# Altium schematic sheet SecurityNode.SchDoc: SecurityNode
size A3; Author: Jeronimo Vargas Orozco; Revision: 1.0; SheetNumber: 1; SheetTotal: 1
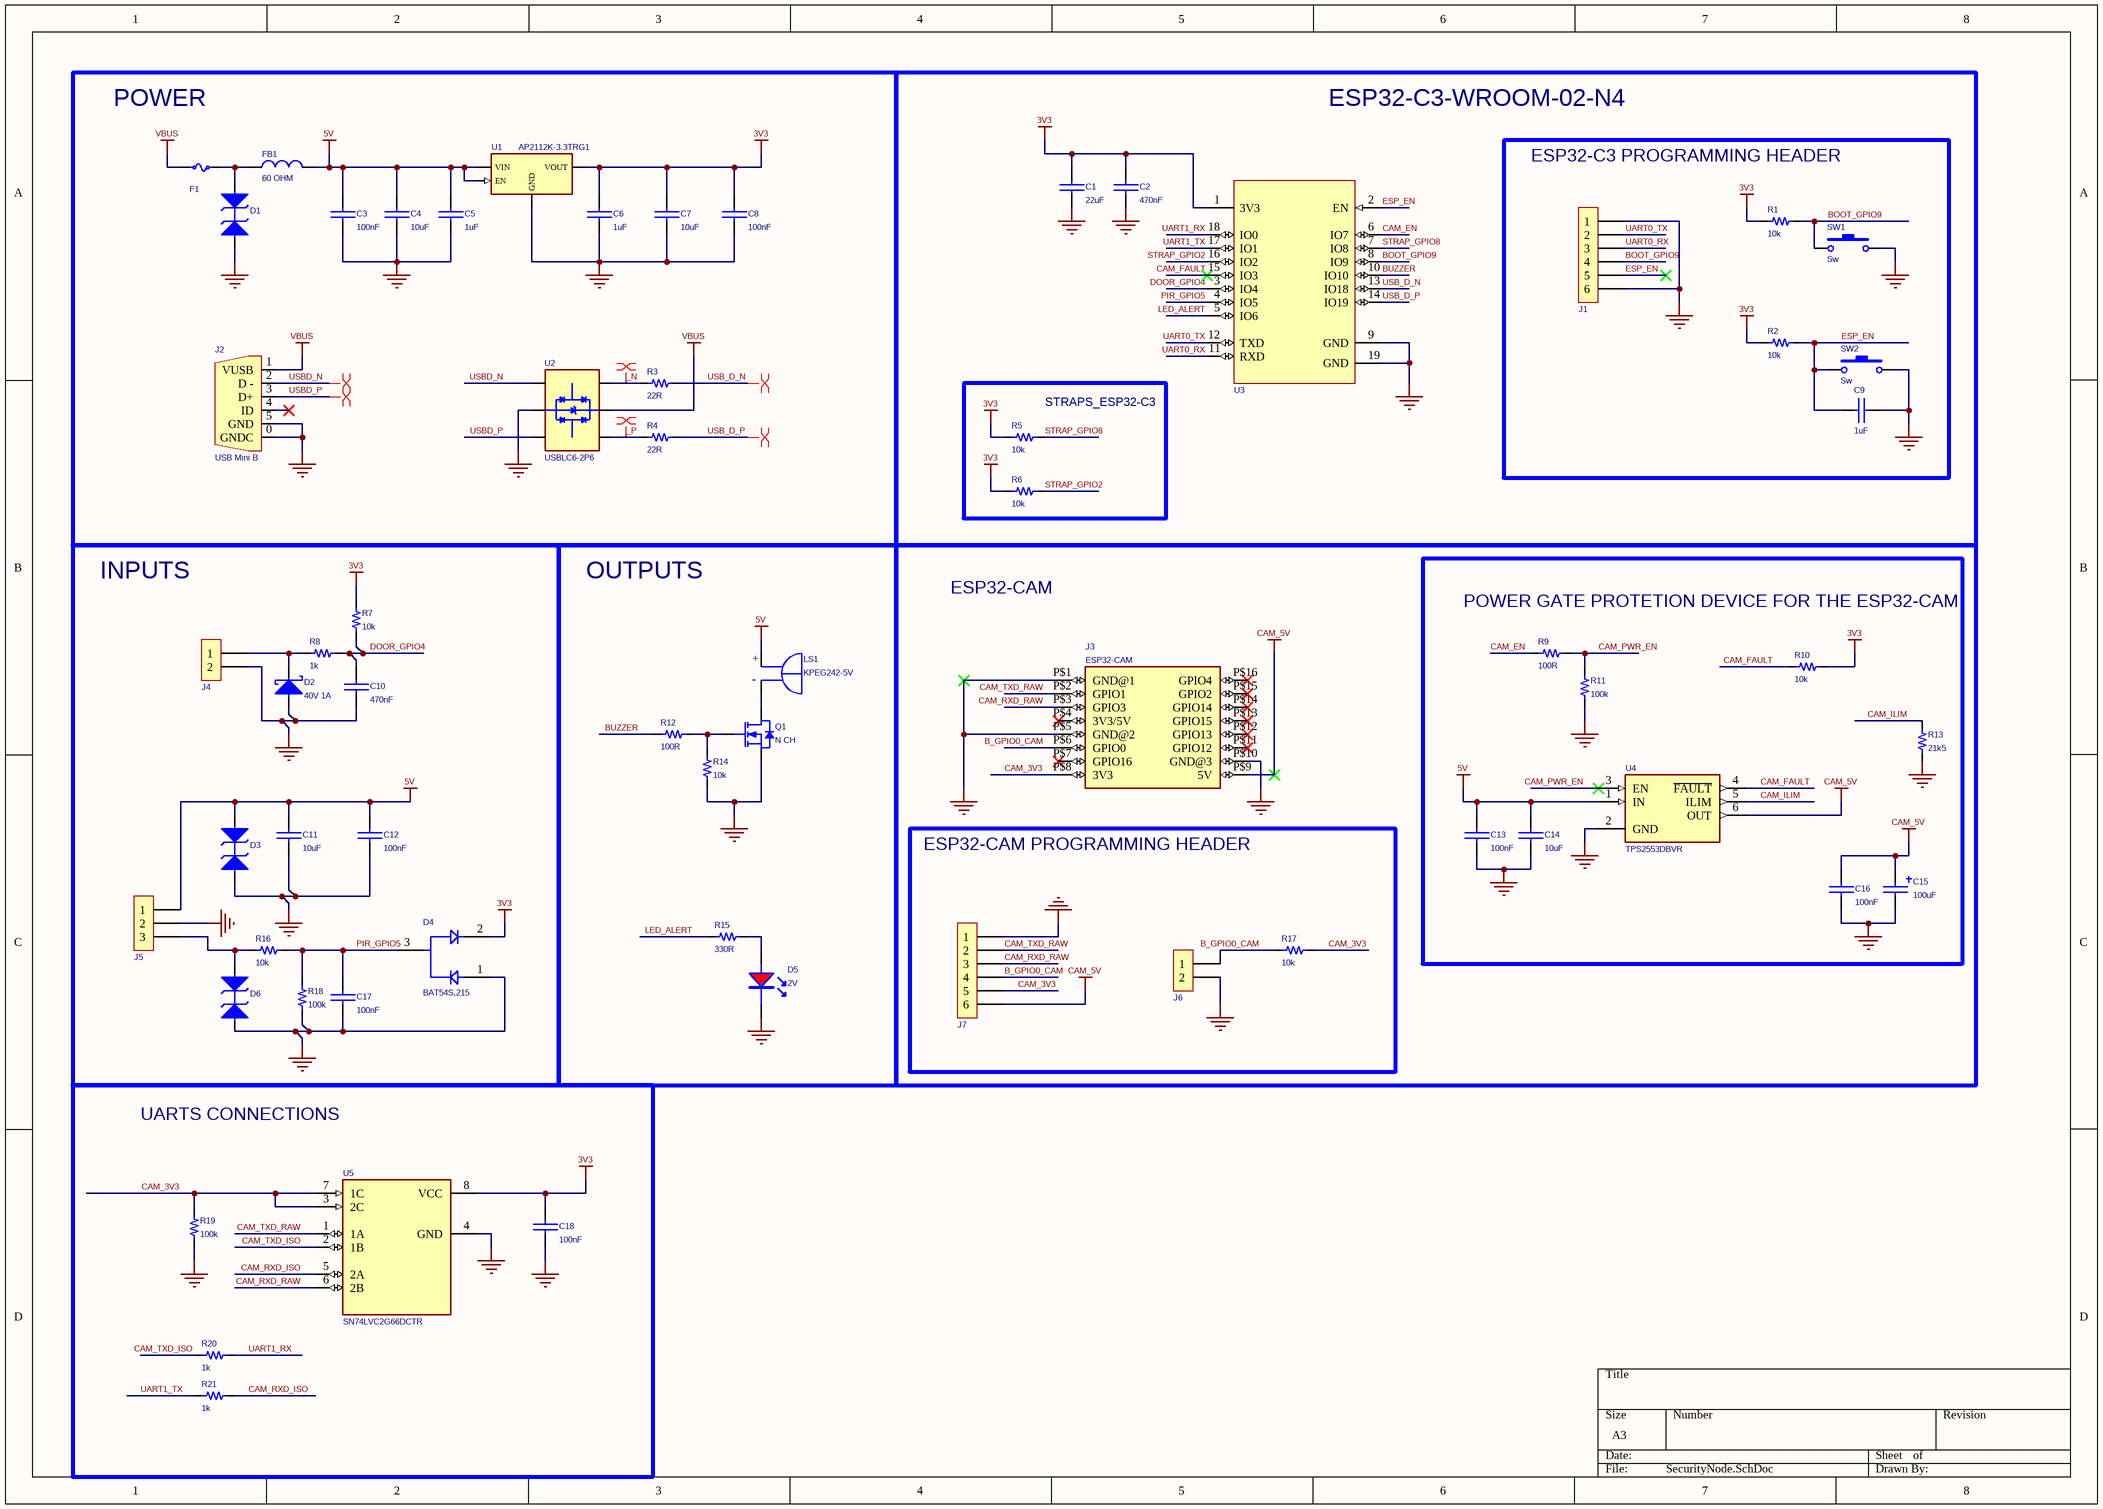
[diagram p0: SecurityNode.SchDoc]

## Parts
C1  value 22uF  [0805_cap]  (hidden comment: 22uF 16V)
C2  value 470nF  [0603_cap]  (hidden comment: 470nF 50V)
C3  value 100nF  [0603_cap]  (hidden comment: 100nF 6.3V)
C4  value 10uF  [0603_cap]  (hidden comment: 10uF 10V)
C5  value 1uF  [0603_cap]  (hidden comment: 1uF 50V)
C6  value 1uF  [0603_cap]  (hidden comment: 1uF 50V)
C7  value 10uF  [0603_cap]  (hidden comment: 10uF 10V)
C8  value 100nF  [0603_cap]  (hidden comment: 100nF 6.3V)
C9  value 1uF  [0603_cap]  (hidden comment: 1uF 50V)
C10  value 470nF  [0603_cap]  (hidden comment: 470nF 50V)
C11  value 10uF  [0603_cap]  (hidden comment: 10uF 10V)
C12  value 100nF  [0603_cap]  (hidden comment: 100nF 6.3V)
C13  value 100nF  [0603_cap]  (hidden comment: 100nF 6.3V)
C14  value 10uF  [0603_cap]  (hidden comment: 10uF 10V)
C15  value 100uF  [CAP_TH_2.5MM_6.3*12MM]  (hidden comment: 100uF 35V)
C16  value 100nF  [0603_cap]  (hidden comment: 100nF 6.3V)
C17  value 100nF  [0603_cap]  (hidden comment: 100nF 6.3V)
C18  value 100nF  [0603_cap]  (hidden comment: 100nF 6.3V)
D1  TVS 12V  [SOD_123FL]  (value not drawn)
D2  40V 1A  [SOD_123]
D3  TVS 12V  [SOD_123FL]  (value not drawn)
D4  BAT54S,215  [SOT23]
D5  2V  [0805_LED]
D6  TVS 12V  [SOD_123FL]  (value not drawn)
F1  YTL 1206L075/16V  [FUSC1608X31N]  (value not drawn)
FB1  value 60 OHM  [0603_fb]  (hidden comment: 60OHM 2A)
J1  6x1  [H_6x1_TH_100mil]  (value not drawn)  (no BOM)
J2  USB Mini B  [CON_5x1_SMD_miniUSB_B]
J3  ESP32-CAM  [ESP32-CAM]
J4  2x1  [H_2x1_TH_100mil]  (value not drawn)  (no BOM)
J5  3x1  [H_3X1_TH_100mil]  (value not drawn)  (no BOM)
J6  2x1  [H_2x1_TH_100mil]  (value not drawn)  (no BOM)
J7  6x1  [H_6x1_TH_100mil]  (value not drawn)  (no BOM)
LS1  KPEG242-5V  [XDCR_KPEG242-5V - duplicate]
Q1  N CH  [SOT_23_3]
R1  value 10k  [0603_res]  (hidden comment: 10k 1/10W)
R2  value 10k  [0603_res]  (hidden comment: 10k 1/10W)
R3  value 22R  [0603_res]  (hidden comment: RES 22Ω ±1% 100mW 0603)
R4  value 22R  [0603_res]  (hidden comment: RES 22Ω ±1% 100mW 0603)
R5  value 10k  [0603_res]  (hidden comment: 10k 1/10W)
R6  value 10k  [0603_res]  (hidden comment: 10k 1/10W)
R7  value 10k  [0603_res]  (hidden comment: 10k 1/10W)
R8  value 1k  [0603_res]  (hidden comment: 1k 1/10W)
R9  value 100R  [0603_res]  (hidden comment: 100R 1/10W)
R10  value 10k  [0603_res]  (hidden comment: 10k 1/10W)
R11  value 100k  [0603_res]  (hidden comment: RES 100kΩ ±1% 100mW 0603)
R12  value 100R  [0603_res]  (hidden comment: 100R 1/10W)
R13  value 21k5  [0603_res]  (hidden comment: RES 21.5kΩ ±1% 100mW 0603)
R14  value 10k  [0603_res]  (hidden comment: 10k 1/10W)
R15  value 330R  [0603_res]  (hidden comment: 330R 1/10W)
R16  value 10k  [0603_res]  (hidden comment: 10k 1/10W)
R17  value 10k  [0603_res]  (hidden comment: 10k 1/10W)
R18  value 100k  [0603_res]  (hidden comment: RES 100kΩ ±1% 100mW 0603)
R19  value 100k  [0603_res]  (hidden comment: RES 100kΩ ±1% 100mW 0603)
R20  value 1k  [0603_res]  (hidden comment: 1k 1/10W)
R21  value 1k  [0603_res]  (hidden comment: 1k 1/10W)
SW1  Sw  [Sw_PUSH_4.5x4.5x5mm]
SW2  Sw  [Sw_PUSH_4.5x4.5x5mm]
U1  AP2112K-3.3TRG1  [SOT95P285X140-5N]
U2  USBLC6-2P6  [SOT50P160X60-6N]
U3  ESP32-C3-WROOM-02-N4  [ESP32-C3-WROOM-02-N4]  (value not drawn)
U4  TPS2553DBVR  [SOT95P280X145-6N]
U5  SN74LVC2G66DCTR  [SN74LVC2G66DCTR]

## Blocks framed on the sheet
POWER: C3-C8 D1 F1 FB1 J2 R3 R4 U1 U2
ESP32-C3-WROOM-02-N4: C1 C2 U3
ESP32-C3 PROGRAMMING HEADER: C9 J1 R1 R2 SW1 SW2
STRAPS_ESP32-C3: R5 R6
INPUTS: C10-C12 C17 D2-D4 D6 J4 J5 R7 R8 R16 R18
OUTPUTS: D5 LS1 Q1 R12 R14 R15
ESP32-CAM: J3
POWER GATE PROTETION DEVICE FOR THE ESP32-CAM: C13-C16 R9-R11 R13 U4
ESP32-CAM PROGRAMMING HEADER: J6 J7 R17
UARTS CONNECTIONS: C18 R19-R21 U5

## Nets
3V3: C1.1 C2.1 C6.1 C7.1 C8.1 C18.1 D4.2 R1.1 R2.1 R5.1 R6.1 R7.2 R10.2 U1.5(VOUT) U3.1(3V3) U5.8(VCC)
5V: C3.1 C4.1 C5.1 C11.1 C12.1 C13.1 C14.1 D3.1 FB1.2 J5.1 LS1.P(POS) U1.1(VIN) U1.3(EN) U4.1(IN)
CAM_5V: C15.1 C16.1 J3.P$9(5V) J7.6 U4.6(OUT)
GND: C1.2 C2.2 C3.2 C4.2 C5.2 C6.2 C7.2 C8.2 C9.2 C10.2 C11.2 C12.2 C13.2 C14.2 C15.2 C16.2 C17.2 C18.2 D1.2 D2.2 D3.2 D4.1 D5.2 D6.2 J1.1 J1.6 J2.0(GNDC) J2.5(GND) J3.P$1(GND@1) J3.P$5(GND@2) J3.P$10(GND@3) J4.2 J5.2 J6.2 J7.1 Q1.2(S) R11.2 R13.2 R14.1 R18.2 R19.1 SW1.2 SW2.2 U1.2(GND) U2.2(GND) U3.9(GND) U3.19(GND) U4.2(GND) U5.4(GND)
VBUS: F1.1 J2.1(VUSB) U2.5(VBUS)
_N: R3.1 U2.6(I/O1_2)
_P: R4.1 U2.4(I/O2_2)
B_GPIO0_CAM: J3.P$6(GPIO0) J6.1 J7.4 R17.1
BOOT_GPIO9: J1.4 R1.2 SW1.1 U3.8(IO9)
BUZZER: R12.1 U3.10(IO10)
CAM_3V3: J3.P$8(3V3) J7.5 R17.2 R19.2 U5.3(2C) U5.7(1C)
CAM_EN: R9.1 U3.6(IO7)
CAM_FAULT: R10.1 U3.15(IO3) U4.4(~{FAULT})
CAM_ILIM: R13.1 U4.5(ILIM)
CAM_PWR_EN: R9.2 R11.1 U4.3(EN)
CAM_RXD_ISO: R21.2 U5.5(2A)
CAM_RXD_RAW: J3.P$3(GPIO3) J7.3 U5.6(2B)
CAM_TXD_ISO: R20.1 U5.2(1B)
CAM_TXD_RAW: J3.P$2(GPIO1) J7.2 U5.1(1A)
DOOR_GPIO4: C10.1 R7.1 R8.2 U3.3(IO4)
ESP_EN: C9.1 J1.5 R2.2 SW2.1 U3.2(EN)
LED_ALERT: R15.1 U3.5(IO6)
PIR_GPIO5: C17.1 D4.3 R16.1 R18.1 U3.4(IO5)
STRAP_GPIO2: R6.2 U3.16(IO2)
STRAP_GPIO8: R5.2 U3.7(IO8)
UART0_RX: J1.3 U3.11(RXD)
UART0_TX: J1.2 U3.12(TXD)
UART1_RX: R20.2 U3.18(IO0)
UART1_TX: R21.1 U3.17(IO1)
USB_D_N: R3.2 U3.13(IO18)
USB_D_P: R4.2 U3.14(IO19)
USBD_N: J2.2(D_-) U2.1(I/O1_1)
USBD_P: J2.3(D+) U2.3(I/O2_1)
NetD1_1: D1.1 F1.2 FB1.1
NetD2_1: D2.1 J4.1 R8.1
NetD5_1: D5.1(A) R15.2
NetD6_1: D6.1 J5.3 R16.2
NetLS1_N: LS1.N(NEG) Q1.3(D)
NetQ1_1: Q1.1(G) R12.2 R14.2

Not connected (* = marked no-connect by the designer): J2 4(ID)*; J3 P$4(3V3/5V)* P$7(GPIO16)* P$11(GPIO12)* P$12(GPIO13)* P$13(GPIO15)* P$14(GPIO14)* P$15(GPIO2)* P$16(GPIO4)*

## Layout directives
differential pair: _N, _P, USB_D_N, USB_D_P, USBD_N, USBD_P

## Notes on the sheet
- (in symbol KPEG242-5V) +; -

## Library data of the parts
C1 = Cap_22uF_0805_16V: 16V 22uF X5R ±20% 0805 Multilayer Ceramic Capacitors MLCC - SMD/SMT ROHS; Manufacturer: Chinocera; Manufacturer Part Number: HGC0805R5226M160NSLJ; Supplier 1: LCSC; Supplier Part Number 1: C33546008; ComponentLink1Description: LCSC; ComponentLink1URL: https://lcsc.com/product-detail/Multilayer-Ceramic-Capacitors-MLCC-SMD-SMT_Chinocera-HGC0805R5226M160NSLJ_C33546008.html
C2 C10 = Cap_470nF_0603_50V: 50V 470nF X7R ±10% 0603 Multilayer Ceramic Capacitors MLCC - SMD/SMT ROHS; Manufacturer: Chinocera; Manufacturer Part Number: HGC0603R7474K500NTHJ; Supplier 1: LCSC; Supplier Part Number 1: C33546006; ComponentLink1Description: LCSC; ComponentLink1URL: https://lcsc.com/product-detail/Multilayer-Ceramic-Capacitors-MLCC-SMD-SMT_Chinocera-HGC0603R7474K500NTHJ_C33546006.html
C3 C8 C12 C13 C16-C18 = Cap_100nF_0603_6.3V: 100nF ±20% 6.3V Ceramic Capacitor X5R 0201; Manufacturer: HRE; Manufacturer Part Number: CGA0201X5R104M6R3ET; Supplier 1: LCSC; Supplier Part Number 1: C46614498; ComponentLink1Description: LCSC; ComponentLink1URL: https://www.lcsc.com/product-detail/C46614498.html?s_z=n_q_t_100nF%2520capacitor&spm=wm.fly.bg.0.xh___wm.ssy.tc.0.tz&lcsc_vid=Q1BYBAFTEgNbVAVeElJeUVBVE1ZZU1xRQlFdXwZeEgMxVlNRTlBdUVZSQFNeUDsOAxUeFF5JWBYZEEoKFBINSQcJGk4NBhADEA4cHktXRlhXSQwSGg0%3D
C4 C7 C11 C14 = Cap_10uF_0603_10V: 10V 10uF X5R ±10% 0603 Multilayer Ceramic Capacitors MLCC - SMD/SMT ROHS; Manufacturer: CCTC; Manufacturer Part Number: TCC0603X5R106K100CT; Supplier 1: LCSC; Supplier Part Number 1: C380314; ComponentLink1Description: LCSC; ComponentLink1URL: https://www.lcsc.com/product-detail/Multilayer-Ceramic-Capacitors-MLCC-SMD-SMT_CCTC-TCC0603X5R106K100CT_C380314.html
C5 C6 C9 = Cap_1uF_0603_50V: 50V 1uF X5R ±10% 0603 Multilayer Ceramic Capacitors MLCC - SMD/SMT ROHS; Manufacturer: Samsung Electro-Mechanics; Manufacturer Part Number: CL10A105KB8NNNC; Supplier 1: LCSC; Supplier Part Number 1: C15849; ComponentLink1Description: LCSC; ComponentLink1URL: https://www.lcsc.com/product-detail/Multilayer-Ceramic-Capacitors-MLCC-SMD-SMT_Samsung-Electro-Mechanics-CL10A105KB8NNNC_C15849.html
C15 = Cap_100uF_ALU_TH_35V: 100uF 35V ±20% Plugin,D6.3xL12mm Aluminum Electrolytic Capacitors - Leaded ROHS; Manufacturer: HRK; Manufacturer Part Number: 35V100uF CD110; Supplier 1: LCSC; Supplier Part Number 1: C2960381; ComponentLink1Description: LCSC; ComponentLink1URL: https://lcsc.com/product-detail/Aluminum-Electrolytic-Capacitors-Leaded_HRK-35V100uF-CD110_C2960381.html
D1 D3 D6 = TVS_5V_1CH_BID_SOD_123FL: 21.7A 200W@10/1000us 9.2V 7V Bidirectional 5V SOD-123FL ESD and Surge Protection (TVS/ESD) ROHS; Manufacturer: TDSEMIC; Manufacturer Part Number: SMF5.0CA; Supplier 1: LCSC; Supplier Part Number 1: C46956338; ComponentLink1Description: LCSC; ComponentLink1URL: https://lcsc.com/product-detail/ESD-and-Surge-Protection-TVS-ESD_TDSEMIC-SMF5-0CA_C46956338.html
D2 = D_Schottky_40V_1A_SOD_123F: DIODE SCHOTTKY 40V 1A SOD123F; Manufacturer: Shanghai Prisemi Elec; Manufacturer Part Number: PSBD1DF40V1H; Supplier 1: LCSC; Supplier Part Number 1: C110730; ComponentLink1Description: LCSC; ComponentLink1URL: https://www.lcsc.com/product-detail/Switching-Diode_Shanghai-Prisemi-Elec-PSBD1DF40V1H_C110730.html
D4 = BAT54S,215: Diode Array 1 Pair Series Connection Schottky 30 V 200mA (DC) Surface Mount TO-236-3, SC-59, SOT-23-3; MF: Nexperia; SnapEDA_Link: https://www.snapeda.com/parts/BAT54S,215/Nexperia/view-part/?ref=snap; Package: SOT23-3 Nexperia USA Inc.; Value: *; MP: BAT54S,215; Check_prices: https://www.snapeda.com/parts/BAT54S,215/Nexperia/view-part/?ref=eda
D5 = LED_0805_RED: LED RED CLEAR 0805 SMD; Manufacturer: XINGLIGHT; Manufacturer Part Number: XL-2012SURC; Supplier 1: LCSC; Supplier Part Number 1: C965812; ComponentLink1Description: LCSC; ComponentLink1URL: https://www.lcsc.com/product-detail/Light-Emitting-Diodes-LED_XINGLIGHT-XL-2012SURC_C965812.html
F1 = YTL 1206L075/16V: 16V 750mA 100A 1.5A 90mΩ 1206 PTC Resettable Fuses RoHS; Manufacturer: Littelfuse Inc; Supplier: LCSC; Supplier Part Number: C49318368; Manufacturer Part Number: 1206L075/16V; Package/Case: 1206; Value: *
FB1 = FB_60_0603_2A: 2A 1 100mΩ 60Ω@100MHz ±25% 0603 Ferrite Beads ROHS; Manufacturer: TAI-TECH; Manufacturer Part Number: HCB1608KF-600T20; ComponentLink1Description: LCSC; ComponentLink1URL: https://www.lcsc.com/product-detail/Ferrite-Beads_TAI-TECH-HCB1608KF-600T20_C369516.html; Supplier 1: LCSC; Supplier Part Number 1: C369516
J1 J7 = H_Male_6x1_TH_100mil: ComponentLink1Description: LCSC
J2 = Con_Mini_USB_B: CONN RCPT USB2.0 MINI B SMD R/A; Manufacturer Part Number: KH-MINI-SMT-5P-Cu; Manufacturer: EDAC Inc.; ComponentLink1Description: LCSC; ComponentLink1URL: https://datasheet.lcsc.com/lcsc/2106070035_Shenzhen-Kinghelm-Elec-KH-MINI-SMT-5P-Cu_C2688795.pdf; Supplier 1: LCSC; Supplier Part Number 1: C2688795
J3 = ESP32-CAM: ESP32 ESP32 Transceiver; 802.11 a/b/g/n (Wi-Fi, WiFi, WLAN), BluetoothÂ® Smart 4.x Low Energy (BLE) Evaluation Board; MF: AI-Thinker; SnapEDA_Link: https://www.snapeda.com/parts/ESP32-CAM/AI-Thinker/view-part/?ref=snap; Package: None; Value: *; MP: ESP32-CAM; Check_prices: https://www.snapeda.com/parts/ESP32-CAM/AI-Thinker/view-part/?ref=eda
J4 J6 = H_Male_2x1_TH_100mil: ComponentLink1Description: LCSC
J5 = H_Male_3x1_TH_100mil: ComponentLink1Description: LCSC
Q1 = Q_NFET_20V_3.2A_SOT23: MOSFET N-CH 20V SOT23; Manufacturer: Doeshare; Manufacturer Part Number: DN2302S; Supplier 1: LCSC; Supplier Part Number 1: C2931750; ComponentLink1Description: LCSC; ComponentLink1URL: https://www.lcsc.com/product-detail/MOSFETs_Doeshare-DN2302S_C2931750.html
R1 R2 R5-R7 R10 R14 R16 R17 = Res_10k_0603_1/10W: RES SMD 10k OHM 5% 1/10W 0603; Manufacturer: FOJAN; Manufacturer Part Number: FRC0603J103TS; ComponentLink1URL: https://www.lcsc.com/product-detail/Chip-Resistor-Surface-Mount_FOJAN-FRC0603J103TS_C2930027.html; Supplier 1: LCSC; Supplier Part Number 1: C2930027; ComponentLink1Description: LCSC
R3 R4 = Res_22R_0603_1/10W: 100mW 22Ω 75V Thick Film Resistor ±100ppm/℃ ±1% 0603 Chip Resistor - Surface Mount RoHS; Manufacturer: UNI-ROYAL; Manufacturer Part Number: 0603WAF220JT5E; ComponentLink1URL: https://www.lcsc.com/product-detail/C23345.html?s_z=h_q_t_22%2520resistor&spm=wm.fly.bg.2.xh___wm.ssy.tc.0.tz&lcsc_vid=Q1BYBAFTEgNbVAVeElJeUVBVE1ZZU1xRQlFdXwZeEgMxVlNRTlReVFNfQVRZVTsOAxUeFF5JWBYZEEoKFBINSQcJGk4dAgUUFAk%3D; Supplier 1: LCSC; Supplier Part Number 1: C23345; ComponentLink1Description: LCSC
R8 R20 R21 = Res_1k_0603_1/10W: RES SMD 1k OHM 5% 1/10W 0603; Manufacturer: FOJAN; Manufacturer Part Number: FRC0603J102 TS; ComponentLink1URL: https://www.lcsc.com/product-detail/Chip-Resistor-Surface-Mount_FOJAN-FRC0603J102-TS_C2907113.html; Supplier 1: LCSC; Supplier Part Number 1: C2907113; ComponentLink1Description: LCSC
R9 R12 = Res_100R_0603_1/10W: RES SMD 100R OHM 5% 1/10W 0603; Manufacturer: FOJAN; Manufacturer Part Number: FRC0603J101 TS; ComponentLink1URL: https://www.lcsc.com/product-detail/Chip-Resistor-Surface-Mount_FOJAN-FRC0603J101-TS_C2907089.html; Supplier 1: LCSC; Supplier Part Number 1: C2907089; ComponentLink1Description: LCSC
R11 R18 R19 = Res_100k_0603_1/8W: 100mW 100kΩ 75V Thick Film Resistor ±100ppm/℃ ±1% 0603 Chip Resistor - Surface Mount RoHS; Manufacturer: YAGEO; Manufacturer Part Number: RC0603FR-07100KL; ComponentLink1URL: https://lcsc.com/product-detail/Chip-Resistor-Surface-Mount_LIZ-Elec-CR0603FA84R5G_C101216.html; Supplier 1: LCSC; Supplier Part Number 1: C101216; ComponentLink1Description: LCSC
R13 = Res_21k5_0603_1/10W: 21.5kΩ 100mW 75V Thick Film Resistor ±100ppm/℃ ±1% 0603 Chip Resistor - Surface Mount RoHS; Manufacturer: YAGEO; Manufacturer Part Number: RC0603FR-0721K5L; ComponentLink1URL: https://www.lcsc.com/product-detail/C112318.html?s_z=n_q_RC0603FR-0721K5L&spm=wm.fly.bg.0.xh&lcsc_vid=Q1BYBAFTEgNbVAVeElJeUVBVE1ZZU1xRQlFdXwZeEgMxVlNRTlBbUVBVQlRbUjsOAxUeFF5JWBYZEEoKFBINSQcJGk4eFQsCAgIaSgADAwAHC0slQ1ZbU1JIHxUDCw%3D%3D; Supplier 1: LCSC; Supplier Part Number 1: C112318; ComponentLink1Description: LCSC
R15 = Res_330R_0603_1/10W: RES SMD 330R OHM 5% 1/10W 0603; Manufacturer: FOJAN; Manufacturer Part Number: FRC0603J331 TS; ComponentLink1URL: https://www.lcsc.com/product-detail/Chip-Resistor-Surface-Mount_FOJAN-FRC0603J331-TS_C2907152.html; Supplier 1: LCSC; Supplier Part Number 1: C2907152; ComponentLink1Description: LCSC
SW1 SW2 = Sw_PUSH_4.5x4.5x5.0xmm: SWITCH TACTILE SPST-NO 0.05A 12V; Manufacturer: BZCN; Manufacturer Part Number: TSC015A05026A; Supplier 1: LCSC; Supplier Part Number 1: C2888509; Last modified by: N-A.Potosi; Last modified date: 20190222; ComponentLink1Description: LCSC; ComponentLink1URL: https://www.lcsc.com/product-detail/Tactile-Switches_BZCN-TSC015A05026A_C2888509.html
U1 = AP2112K-3.3TRG1: Linear Voltage Regulator IC Positive Fixed 1 Output 600mA SOT-25; MF: Diodes Inc.; Value: *; Purchase-URL: https://pricing.snapeda.com/search/part/AP2112K-3.3TRG1/?ref=eda; Package: SOT-753 Diodes Inc.; Availability: In Stock; Check_prices: https://www.snapeda.com/parts/AP2112K-3.3TRG1/Diodes+Inc./view-part/?ref=eda; Price: None; SnapEDA_Link: https://www.snapeda.com/parts/AP2112K-3.3TRG1/Diodes+Inc./view-part/?ref=snap; MP: AP2112K-3.3TRG1
U2 = USBLC6-2P6: 17VC Clamp 5A@8/20us Ipp ESD DIODE SOT-666-6; Manufacturer: ST; ComponentLink1Description: Link; ComponentLink1URL: https://www.lcsc.com/product-detail/C15999.html?s_z=n_q_USBLC6-2P6&spm=wm.fly.bg.0.xh&lcsc_vid=Q1BYBAFTEgNbVAVeElJeUVBVE1ZZU1xRQlFdXwZeEgMxVlNRTlBaX1FTQ1NXUTsOAxUeFF5JWBYZEEoKFBINSQcJGk4%3D; Manufacturer Pad Number: USBLC6-2P6; Supplier: LCSC; Supplier Pad Number: C15999; Package: SOT-666-6
U3 = MCU_ESP32-C3-WROOM-02-N4: RF TXRX MOD BT WIFI PCB TH SMD; Manufacturer: Espressif Systems; Manufacturer Part Number: ESP32-C3-WROOM-02-N4; Supplier 1: LCSC; Supplier Part Number 1: C2934560; ComponentLink1Description: LCSC; ComponentLink1URL: https://lcsc.com/product-detail/WiFi-Modules_Espressif-Systems-ESP32-C3-WROOM-02-N4_C2934560.html
U4 = TPS2553DBVR: 0.075-1.7A adj. ILIMIT, 2.5-6.5V, 85mÎ© USB power switch, active-high, reverse blocking; MF: Texas Instruments; SnapEDA_Link: https://www.snapeda.com/parts/TPS2553DBVR/Texas+Instruments/view-part/?ref=snap; Package: SOT-23-6 Texas Instruments; Value: *; MP: TPS2553DBVR; Check_prices: https://www.snapeda.com/parts/TPS2553DBVR/Texas+Instruments/view-part/?ref=eda
U5 = SN74LVC2G66DCTR: 5-V, 1:1 (SPST), 2-channel general-purpose analog switch with low on-state resistance; MF: Texas Instruments; SnapEDA_Link: https://www.snapeda.com/parts/SN74LVC2G66DCTR/Texas+Instruments/view-part/?ref=snap; Package: SSOP-8 Texas Instruments; Value: *; MP: SN74LVC2G66DCTR; Check_prices: https://www.snapeda.com/parts/SN74LVC2G66DCTR/Texas+Instruments/view-part/?ref=eda
LS1 = KPEG242-5V: Availability: Unavailable; Price: None; Package: None; Value: *; MP: KPEG242-5V